# Altium project Test_Library.PrjPcb
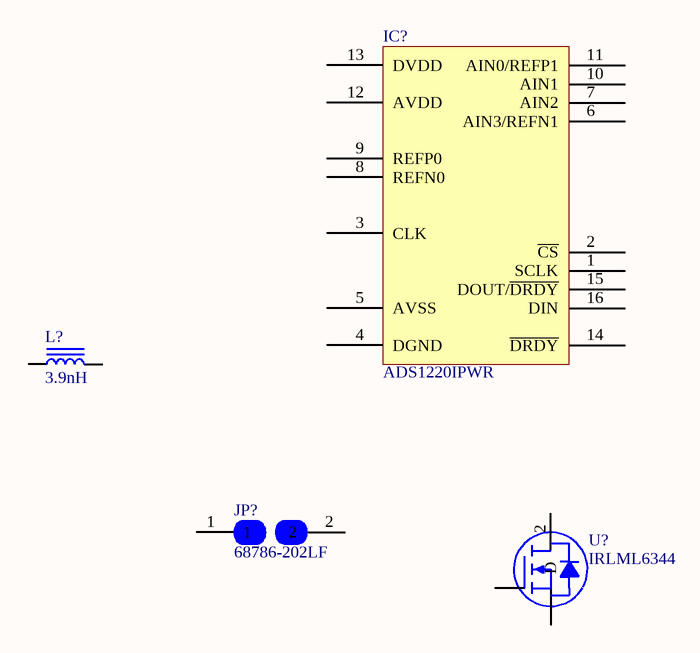
[diagram p0: Test_Symbol.SchDoc]
1 sheet, 4 parts. Net scope: global (net labels, ports and power ports of the same name join across sheets).
Board file: Test_PCB.PcbDoc

## Sheet Test_Symbol.SchDoc
size A4; SheetNumber: 1; SheetTotal: 1

### Parts
IC?  ADS1220IPWR  [TI TSSOP-16 PW]
JP?  68786-202LF  [FCI_68786-202LF]
L?  3.9nH  [IND 0402/1005 RF WW]
U?  IRLML6344  [SOT95P240X112-3N]

### Nets

Not connected (* = marked no-connect by the designer): IC? 1(SCLK) 2(~{CS}) 3(CLK) 4(DGND) 5(AVSS) 6(AIN3/REFN1) 7(AIN2) 8(REFN0) 9(REFP0) 10(AIN1) 11(AIN0/REFP1) 12(AVDD) 13(DVDD) 14(~{DRDY}) 15(DOUT/~{DRDY}) 16(DIN); JP? 1 2; L? 1 2; U? 1(G) 2(D) 3(S)

### Library data of the parts
IC? = ADS1220IPWR: IC ADC 24-BIT 2KSPS 16-TSSOP; Manufacturer: Texas Instruments; Number of Bits: 24; Samping Rate: 2k; Number of Inputs: 2, 4; Input Type: Differential, Single Ended; Data Interface: SPI; Configuration: MUX-PGA-ADC; Number of A/D Converters: 1; Architecture: Sigma-Delta; Reference Type: External, Internal; Voltage - Supply, Analog: 2.3 V ~ 5.5 V; Part Number: ADS1220IPWR; PartId: 15702; Supplier 1: Digi-Key; Supplier Part Number 1: 296-39851-1-ND; ComponentLink1Description: Datasheet; ComponentLink1URL: http://www.ti.com/lit/ds/symlink/ads1220.pdf; ComponentLink2Description: Digi-Key Listing; ComponentLink2URL: http://www.digikey.com/product-detail/en/texas-instruments/ADS1220IPWR/296-39851-1-ND/5177728; Price: 8.71; Type: ADC; Device Package: 16-TSSOP (0.173", 4.40mm Width); Series: -; Ratio - S/H:ADC: -; Voltage - Supply, Digital: 2.3 V ~ 5.5 V; Features: PGA, Temperature Sensor
JP? = 68786-202LF: Jumper Low Profile , Single Row, 2 Positions, 2.54mm (0.100in) Pitch; MF: FCI; SnapEDA_Link: https://www.snapeda.com/parts/68786-202LF/Framatome%20Connectors/view-part/4792913/?ref=snap; MP: 68786-202LF; Price: None; Package: None; Value: *; Check_prices: https://www.snapeda.com/parts/68786-202LF/Framatome%20Connectors/view-part/4792913/?ref=eda; Purchase-URL: https://pricing.snapeda.com/search/part/68786-202LF/?ref=eda; Availability: Good
L? = LQW15AN3N9D10D: FIXED IND 3.9NH 900MA 40 MOHM; Manufacturer: Murata Electronics North America; TemperatureRange: -55C ~ 125C; Tolerance: 0.5nH; Type: Wirewound; Q at Frequency: 30 @ 250MHz; DC Resistance: 40 mOhm Max; Shielding: Unshielded; Value: 3.9nH; Part Number: LQW15AN3N9D10D; PartId: 6435; Supplier 1: Digi-Key; Supplier Part Number 1: 490-6815-2-ND; ComponentLink1Description: Datasheet; ComponentLink1URL: http://search.murata.co.jp/Ceramy/image/img/PDF/ENG/L0075S0080LQW15A_10.pdf; ComponentLink2Description: Digi-Key listing; ComponentLink2URL: http://digikey.com/product-detail/en/LQW15AN3N9D10D/490-6815-2-ND/2594912; Price: 0.0843; Device Package: 0402 (1005 Metric)
U? = 2N700: N-Channel 60V 2A _Ta_ 400mW Surface Mount Micro SOT-23; MF: Infineon Technologies; MP: IRLML6344TRPBF; Package: SOT-23 Infineon; Value: *; Price: None; Availability: Unavailable; SnapEDA_Link: https://www.snapeda.com/parts/IRLML6344TRPBF/Infineon%20Technologies/view-part/1786730/?ref=snap